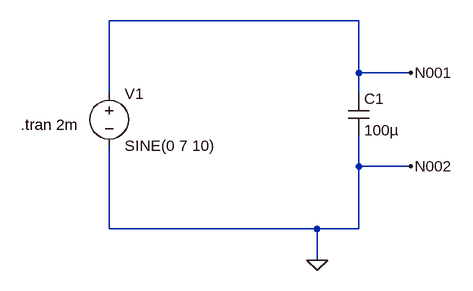
[diagram p0: schematic LAB02 - Task 1.asc]
LAB02 - Task 1.asc, the LTspice schematic file:
Version 4
SHEET 1 880 680
WIRE 624 224 240 224
WIRE 624 304 624 224
WIRE 704 304 624 304
WIRE 240 336 240 224
WIRE 624 336 624 304
WIRE 624 448 624 400
WIRE 704 448 624 448
WIRE 240 544 240 416
WIRE 560 544 240 544
WIRE 624 544 624 448
WIRE 624 544 560 544
WIRE 560 592 560 544
FLAG 560 592 0
FLAG 704 304 N001
FLAG 704 448 N002
SYMBOL voltage 240 320 R0
SYMATTR InstName V1
SYMATTR Value SINE(0 7 10)
SYMBOL cap 608 336 R0
SYMATTR InstName C1
SYMATTR Value 100µ
SYMATTR SpiceLine V=ishay mfg="   ---" pn="   ---" type="   ---"
TEXT 104 384 Left 2 !.tran 2m

The netlist it stands for:
* LAB02 - Task 1.asc
V1 N001 0 SINE(0 7 10)
C1 N001 0 100µ V=ishay mfg="   ---" pn="   ---" type="   ---"
.tran 2m
.backanno
.end